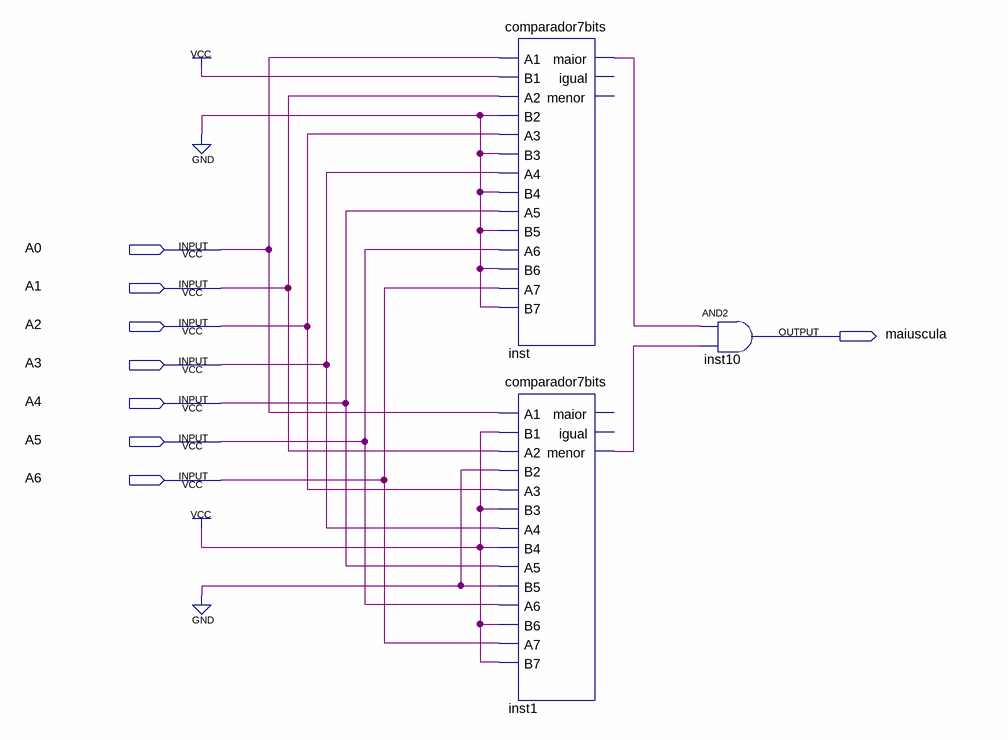
[diagram p0: schematic sheet]
// Quartus schematic tipoMaiuscula.bdf as structural Verilog: 3 symbols, 8 pins
module tipoMaiuscula (
  input  A0,
  input  A1,
  input  A2,
  input  A3,
  input  A4,
  input  A5,
  input  A6,
  output maiuscula
);

  wire inst1_menor, inst_maior;

  comparador7bits inst (
    .A1(A0), .B1(1'b1), .A2(A1), .B2(1'b0), .A3(A2), .B3(1'b0), .A4(A3), .B4(1'b0), .A5(A4), .B5(1'b0),
    .A6(A5), .B6(1'b0), .A7(A6), .B7(1'b0), .maior(inst_maior));  // open: igual, menor
  comparador7bits inst1 (
    .A1(A0), .B1(1'b1), .A2(A1), .B2(1'b0), .A3(A2), .B3(1'b1), .A4(A3), .B4(1'b1), .A5(A4), .B5(1'b0),
    .A6(A5), .B6(1'b1), .A7(A6), .B7(1'b1), .menor(inst1_menor));  // open: maior, igual
  and inst10 (maiuscula, inst_maior, inst1_menor);
endmodule
